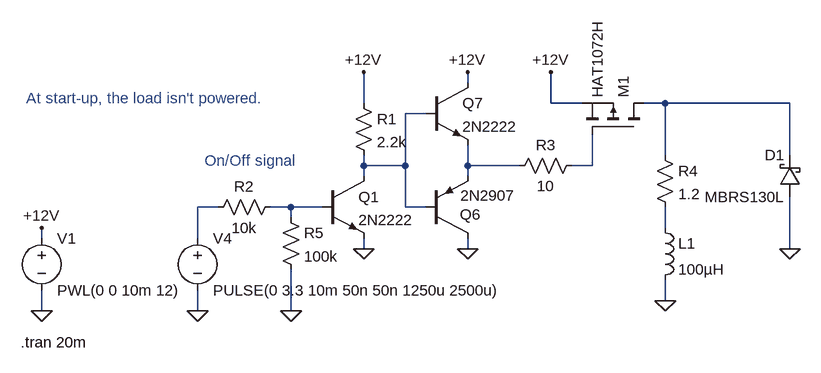
[diagram p0: schematic high_side_p_mos_switch_0_1.asc]
high_side_p_mos_switch_0_1.asc, the LTspice schematic file:
Version 4
SHEET 1 2696 800
WIRE 1360 368 1360 352
WIRE 1200 400 1200 352
WIRE 1488 400 1488 352
WIRE 1536 400 1488 400
WIRE 1664 400 1632 400
WIRE 1856 400 1664 400
WIRE 1296 416 1264 416
WIRE 1664 480 1664 400
WIRE 1856 480 1856 400
WIRE 1200 496 1200 480
WIRE 1264 496 1264 416
WIRE 1264 496 1200 496
WIRE 1360 496 1360 464
WIRE 1440 496 1360 496
WIRE 1552 496 1552 448
WIRE 1552 496 1520 496
WIRE 1200 512 1200 496
WIRE 1360 512 1360 496
WIRE 976 560 944 560
WIRE 1088 560 1056 560
WIRE 1136 560 1088 560
WIRE 1264 560 1264 496
WIRE 1296 560 1264 560
WIRE 1088 576 1088 560
WIRE 1664 592 1664 560
WIRE 704 608 704 592
WIRE 944 608 944 560
WIRE 1200 624 1200 608
WIRE 1360 624 1360 608
WIRE 1856 624 1856 544
WIRE 1664 704 1664 672
WIRE 704 720 704 688
WIRE 944 720 944 688
WIRE 1088 720 1088 656
FLAG 944 720 0
FLAG 704 720 0
FLAG 704 592 +12V
FLAG 1360 352 +12V
FLAG 1360 624 0
FLAG 1200 624 0
FLAG 1200 352 +12V
FLAG 1488 352 +12V
FLAG 1088 720 0
FLAG 1856 624 0
FLAG 1664 704 0
SYMBOL pnp 1296 608 M180
WINDOW 0 52 37 Left 2
WINDOW 3 53 66 Left 2
SYMATTR InstName Q6
SYMATTR Value 2N2907
SYMBOL npn 1296 368 R0
SYMATTR InstName Q7
SYMATTR Value 2N2222
SYMBOL voltage 944 592 R0
WINDOW 123 0 0 Left 2
WINDOW 39 0 0 Left 2
SYMATTR InstName V4
SYMATTR Value PULSE(0 3.3 10m 50n 50n 1250u 2500u)
SYMBOL voltage 704 592 R0
WINDOW 123 0 0 Left 2
WINDOW 39 0 0 Left 2
SYMATTR InstName V1
SYMATTR Value PWL(0 0 10m 12)
SYMBOL npn 1136 512 R0
SYMATTR InstName Q1
SYMATTR Value 2N2222
SYMBOL res 1184 384 R0
SYMATTR InstName R1
SYMATTR Value 2.2k
SYMBOL res 1072 544 R90
WINDOW 0 0 56 VBottom 2
WINDOW 3 32 56 VTop 2
SYMATTR InstName R2
SYMATTR Value 10k
SYMBOL res 1536 480 R90
WINDOW 0 0 56 VBottom 2
WINDOW 3 32 56 VTop 2
SYMATTR InstName R3
SYMATTR Value 10
SYMBOL pmos 1632 448 M270
SYMATTR InstName M1
SYMATTR Value HAT1072H
SYMBOL res 1648 464 R0
SYMATTR InstName R4
SYMATTR Value 1.2
SYMBOL res 1072 560 R0
SYMATTR InstName R5
SYMATTR Value 100k
SYMBOL schottky 1872 544 R180
WINDOW 0 24 64 Left 2
WINDOW 3 24 0 Left 2
SYMATTR InstName D1
SYMATTR Value MBRS130L
SYMATTR Description Diode
SYMATTR Type diode
SYMBOL ind 1648 576 R0
SYMATTR InstName L1
SYMATTR Value 100µH
TEXT 1096 488 Right 2 ;On/Off signal
TEXT 672 768 Left 2 !.tran 20m
TEXT 680 392 Left 2 ;At start-up, the load isn't powered.

The netlist it stands for:
* high_side_p_mos_switch_0_1.asc
Q6 0 N002 N003 0 2N2907
Q7 +12V N002 N003 0 2N2222
V4 N005 0 PULSE(0 3.3 10m 50n 50n 1250u 2500u)
V1 +12V 0 PWL(0 0 10m 12)
Q1 N002 N006 0 0 2N2222
R1 +12V N002 2.2k
R2 N006 N005 10k
R3 N004 N003 10
M1 N001 N004 +12V +12V HAT1072H
R4 N001 N007 1.2
R5 N006 0 100k
D1 0 N001 MBRS130L
L1 N007 0 100µH
.model D D
.lib standard.dio
.model NPN NPN
.model PNP PNP
.lib standard.bjt
.model NMOS NMOS
.model PMOS PMOS
.lib standard.mos
* On/Off signal
.tran 20m
* At start-up, the load isn't powered.
.backanno
.end